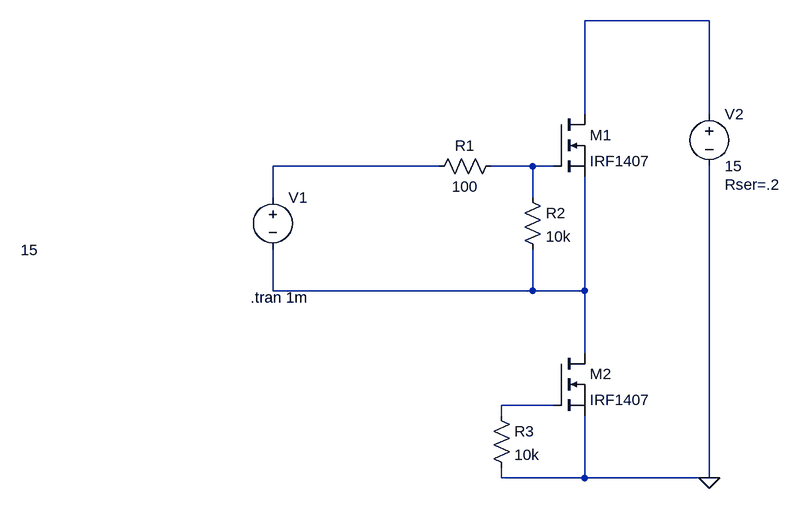
[diagram p0: schematic Inverter - Copy.asc]
Inverter - Copy.asc, the LTspice schematic file:
Version 4
SHEET 1 1084 844
WIRE 256 16 64 16
WIRE 64 160 64 16
WIRE 256 160 256 16
WIRE -160 240 -416 240
WIRE -16 240 -80 240
WIRE 16 240 -16 240
WIRE -416 288 -416 240
WIRE -16 288 -16 240
WIRE -416 432 -416 368
WIRE -16 432 -16 368
WIRE -16 432 -416 432
WIRE 64 432 64 256
WIRE 64 432 -16 432
WIRE 64 528 64 432
WIRE 16 608 -64 608
WIRE -64 624 -64 608
WIRE -64 720 -64 704
WIRE 64 720 64 624
WIRE 64 720 -64 720
WIRE 256 720 256 240
WIRE 256 720 64 720
FLAG 256 720 0
SYMBOL nmos 16 160 R0
SYMATTR InstName M1
SYMATTR Value IRF1407
SYMBOL voltage -416 272 R0
WINDOW 3 -388 97 Left 2
WINDOW 123 0 0 Left 2
WINDOW 39 0 0 Left 2
SYMATTR InstName V1
SYMATTR Value 15
SYMBOL res -64 224 R90
WINDOW 0 0 56 VBottom 2
WINDOW 3 32 56 VTop 2
SYMATTR InstName R1
SYMATTR Value 100
SYMBOL voltage 256 144 R0
WINDOW 123 0 0 Left 2
WINDOW 39 24 124 Left 2
SYMATTR InstName V2
SYMATTR Value 15
SYMATTR SpiceLine Rser=.2
SYMBOL res -32 272 R0
SYMATTR InstName R2
SYMATTR Value 10k
SYMBOL nmos 16 528 R0
SYMATTR InstName M2
SYMATTR Value IRF1407
SYMBOL res -80 608 R0
SYMATTR InstName R3
SYMATTR Value 10k
TEXT -450 442 Left 2 !.tran 1m

The netlist it stands for:
* Inverter - Copy.asc
M1 N001 N003 N004 N004 IRF1407
V1 N002 N004 15
R1 N003 N002 100
V2 N001 0 15 Rser=.2
R2 N003 N004 10k
M2 N004 N005 0 0 IRF1407
R3 N005 0 10k
.model NMOS NMOS
.model PMOS PMOS
.lib standard.mos
.tran 1m
.backanno
.end